# EAGLE design Shutdown Board (EAGLE 7.1.0)
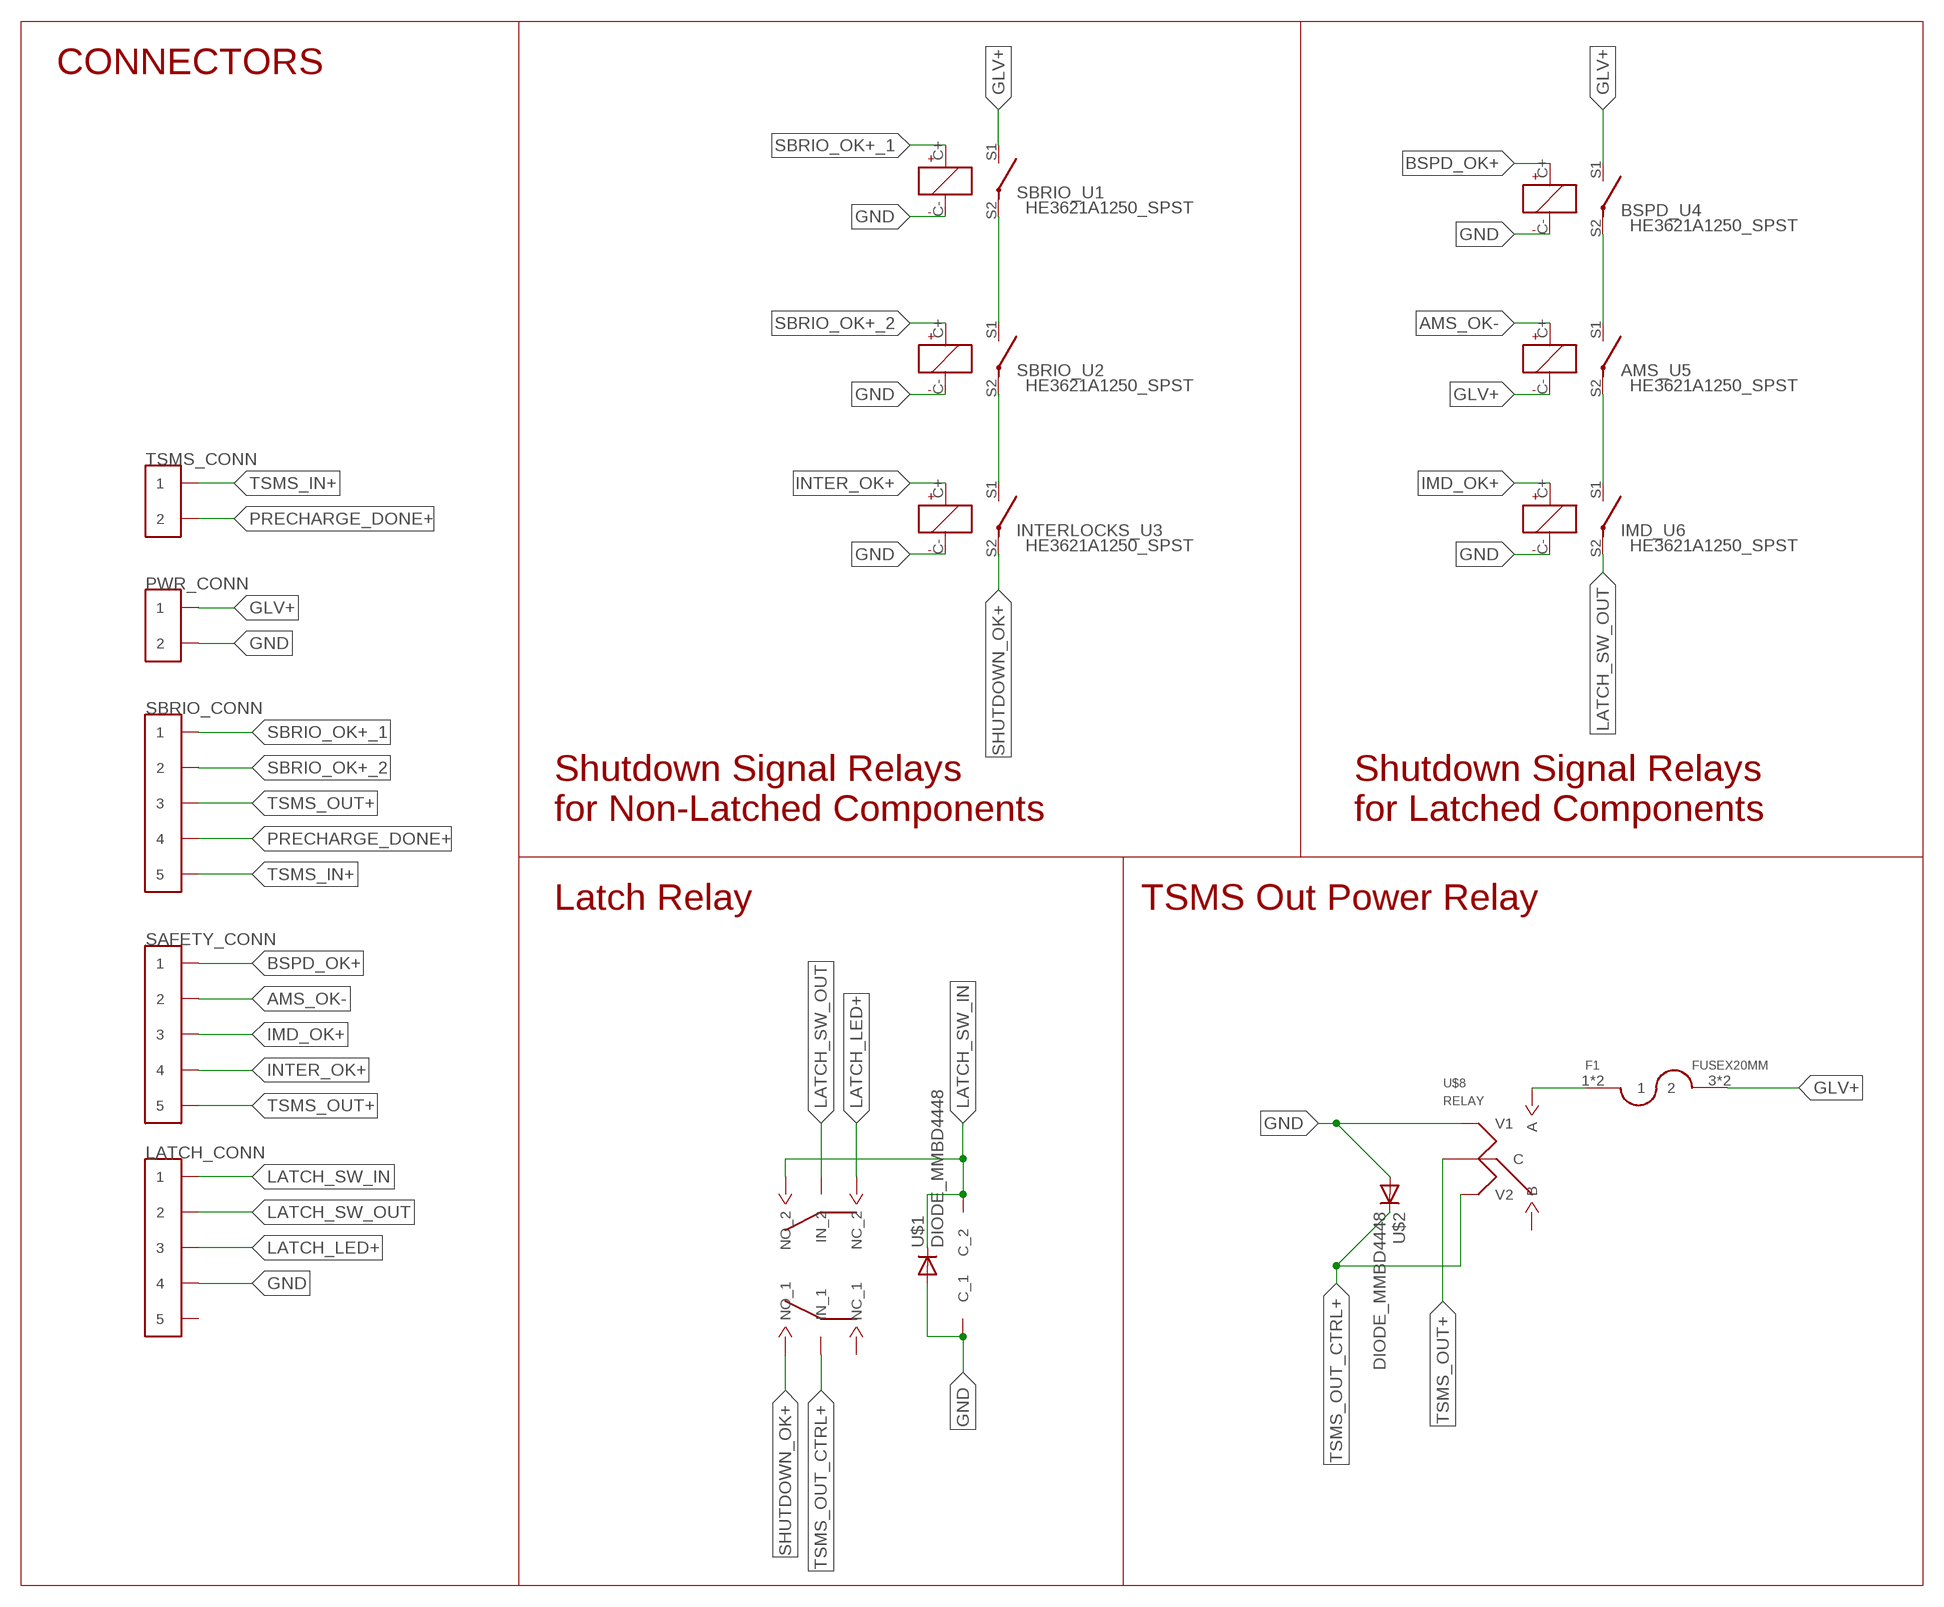
[diagram p0: schematic, sheet 1]

## Parts
AMS_U5  HE3621A1250_SPST  [HE3621A1250_SPST]
BSPD_U4  HE3621A1250_SPST  [HE3621A1250_SPST]
F1  FUSEX20MM  [FUSE_5MM]
IMD_U6  HE3621A1250_SPST  [HE3621A1250_SPST]
INTERLOCKS_U3  HE3621A1250_SPST  [HE3621A1250_SPST]
LATCH_CONN  CONN_5  [CONNECTOR_5]
LATCH_U7  JW2SN-DC12V  [DPDT_JW2_FORM_C]
PWR_CONN  CONN_2  [CONNECTOR_2]
SAFETY_CONN  CONN_5  [CONNECTOR_5]
SBRIO_CONN  CONN_5  [CONNECTOR_5]
SBRIO_U1  HE3621A1250_SPST  [HE3621A1250_SPST]
SBRIO_U2  HE3621A1250_SPST  [HE3621A1250_SPST]
TSMS_CONN  CONN_2  [CONNECTOR_2]
U$1  DIODE_MMBD4448  [SOT-23-3]
U$2  DIODE_MMBD4448  [SOT-23-3]
U$8  RELAY  [RELAY]

## Nets
AMS_OK-: AMS_U5.C+ SAFETY_CONN.3 SAFETY_CONN.4
BSPD_OK+: BSPD_U4.C+ SAFETY_CONN.1 SAFETY_CONN.2
GLV+: AMS_U5.C- BSPD_U4.S1(SW_1) F1.3 F1.4 PWR_CONN.1 PWR_CONN.2 SBRIO_U1.S1(SW_1)
GND: BSPD_U4.C- IMD_U6.C- INTERLOCKS_U3.C- LATCH_CONN.7 LATCH_CONN.8 LATCH_U7.COIL_1(C_1) PWR_CONN.3 PWR_CONN.4 SBRIO_U1.C- SBRIO_U2.C- U$1.P$2(A) U$2.P$2(A) U$8.V1
IMD_OK+: IMD_U6.C+ SAFETY_CONN.5 SAFETY_CONN.6
INTER_OK+: INTERLOCKS_U3.C+ SAFETY_CONN.7 SAFETY_CONN.8
LATCH_LED+: LATCH_CONN.5 LATCH_CONN.6 LATCH_U7.NC_2
LATCH_SW_IN: LATCH_CONN.1 LATCH_CONN.2 LATCH_U7.COIL_2(C_2) LATCH_U7.NO_2 U$1.P$1(C)
LATCH_SW_OUT: IMD_U6.S2(SW_2) LATCH_CONN.3 LATCH_CONN.4 LATCH_U7.CENTER_2(IN_2)
N$6: SBRIO_U1.S2(SW_2) SBRIO_U2.S1(SW_1)
N$7: INTERLOCKS_U3.S1(SW_1) SBRIO_U2.S2(SW_2)
N$8: AMS_U5.S1(SW_1) BSPD_U4.S2(SW_2)
N$9: AMS_U5.S2(SW_2) IMD_U6.S1(SW_1)
N$19: F1.1 F1.2 U$8.A
PRECHARGE_DONE+: SBRIO_CONN.7 SBRIO_CONN.8 TSMS_CONN.3 TSMS_CONN.4
SBRIO_OK+_1: SBRIO_CONN.1 SBRIO_CONN.2 SBRIO_U1.C+
SBRIO_OK+_2: SBRIO_CONN.3 SBRIO_CONN.4 SBRIO_U2.C+
SHUTDOWN_OK+: INTERLOCKS_U3.S2(SW_2) LATCH_U7.NO_1
TSMS_IN+: SBRIO_CONN.9 SBRIO_CONN.10 TSMS_CONN.1 TSMS_CONN.2
TSMS_OUT+: SAFETY_CONN.9 SAFETY_CONN.10 SBRIO_CONN.5 SBRIO_CONN.6 U$8.CENTER(C)
TSMS_OUT_CTRL+: LATCH_U7.CENTER_1(IN_1) U$2.P$1(C) U$8.V2
Unconnected: LATCH_CONN.9 LATCH_CONN.10 LATCH_U7.NC_1 U$8.B

## Notes on the sheet
- CONNECTORS
- Shutdown Signal Relays
  for Non-Latched Components
- Shutdown Signal Relays
  for Latched Components
- Latch Relay | TSMS Out Power Relay

## Library data of the parts
AMS_U5 BSPD_U4 IMD_U6 INTERLOCKS_U3 SBRIO_U1 SBRIO_U2 = formula electric:HE3621A1250_SPST
F1 = SparkFun-Passives:FUSE
LATCH_CONN SAFETY_CONN SBRIO_CONN = formula electric:CONN_5
LATCH_U7 = formula electric:JW2SN-DC12V: JW2SN-DC12V, DPDT 5A 12V Coil Relay, Digikey: 255-1117-ND
PWR_CONN TSMS_CONN = formula electric:CONN_2
U$1 U$2 = formula electric:DIODE_MMBD4448
U$8 = formula electric:RELAY: Digikey: PB1321-ND

## Board
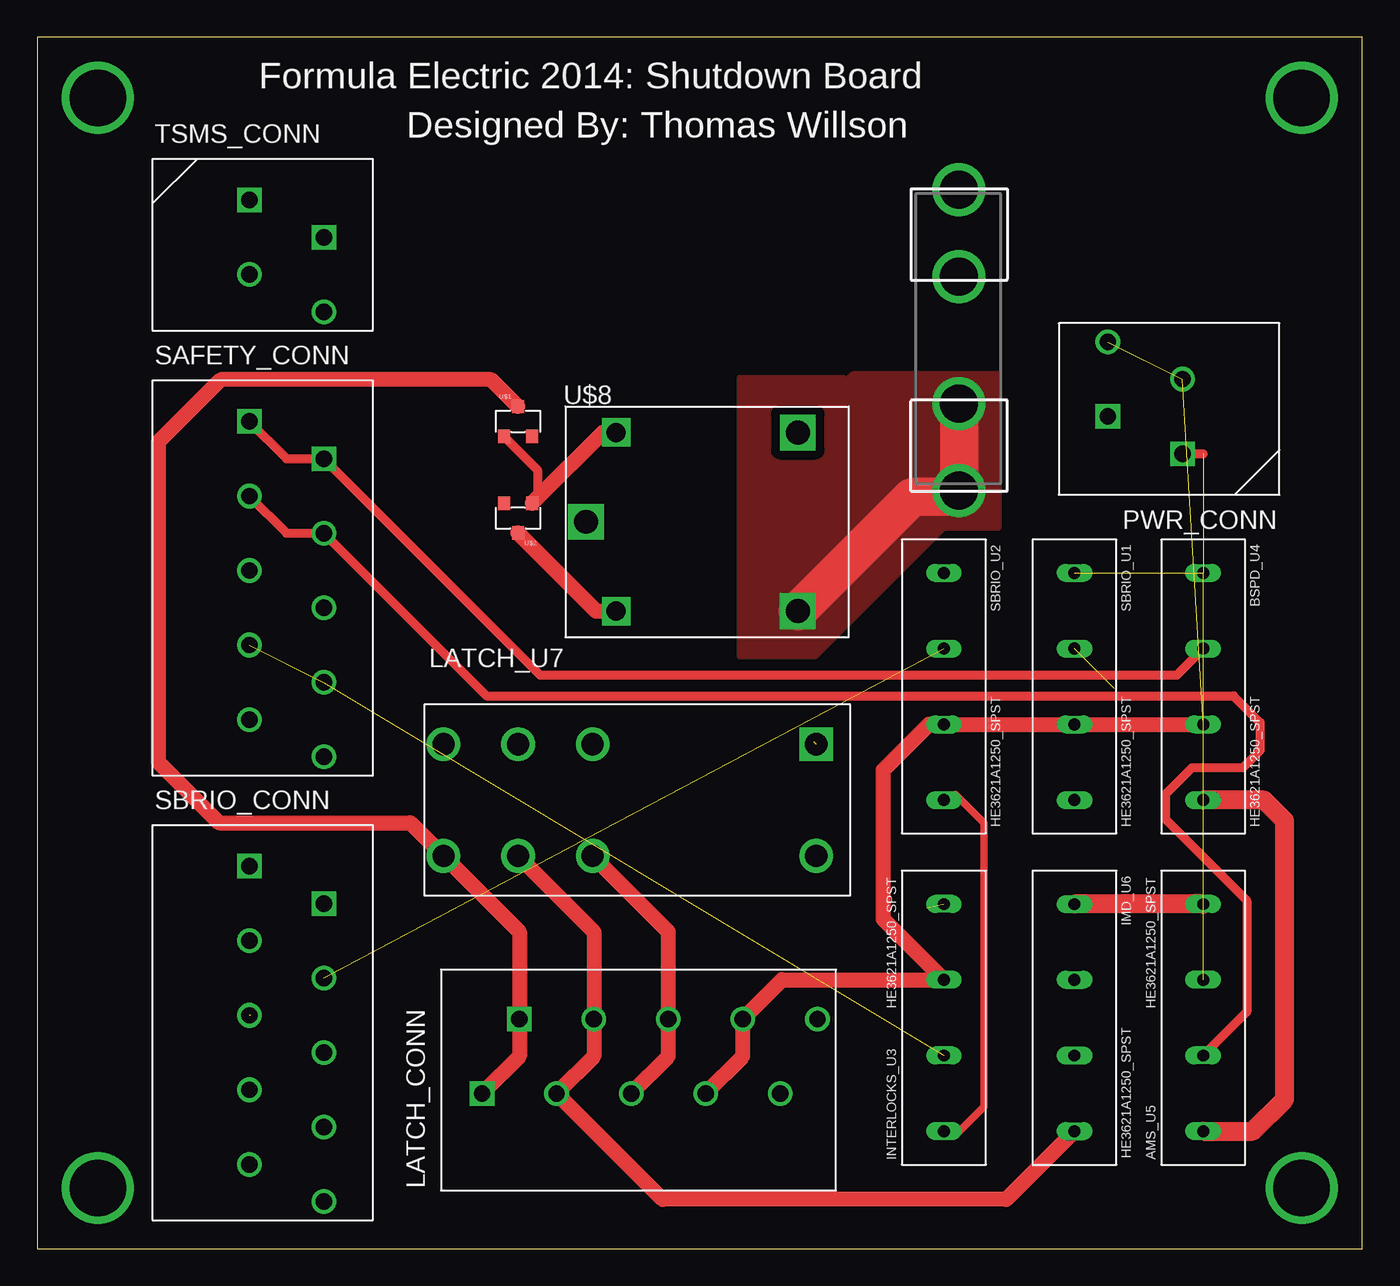
[diagram p1: board, top side]
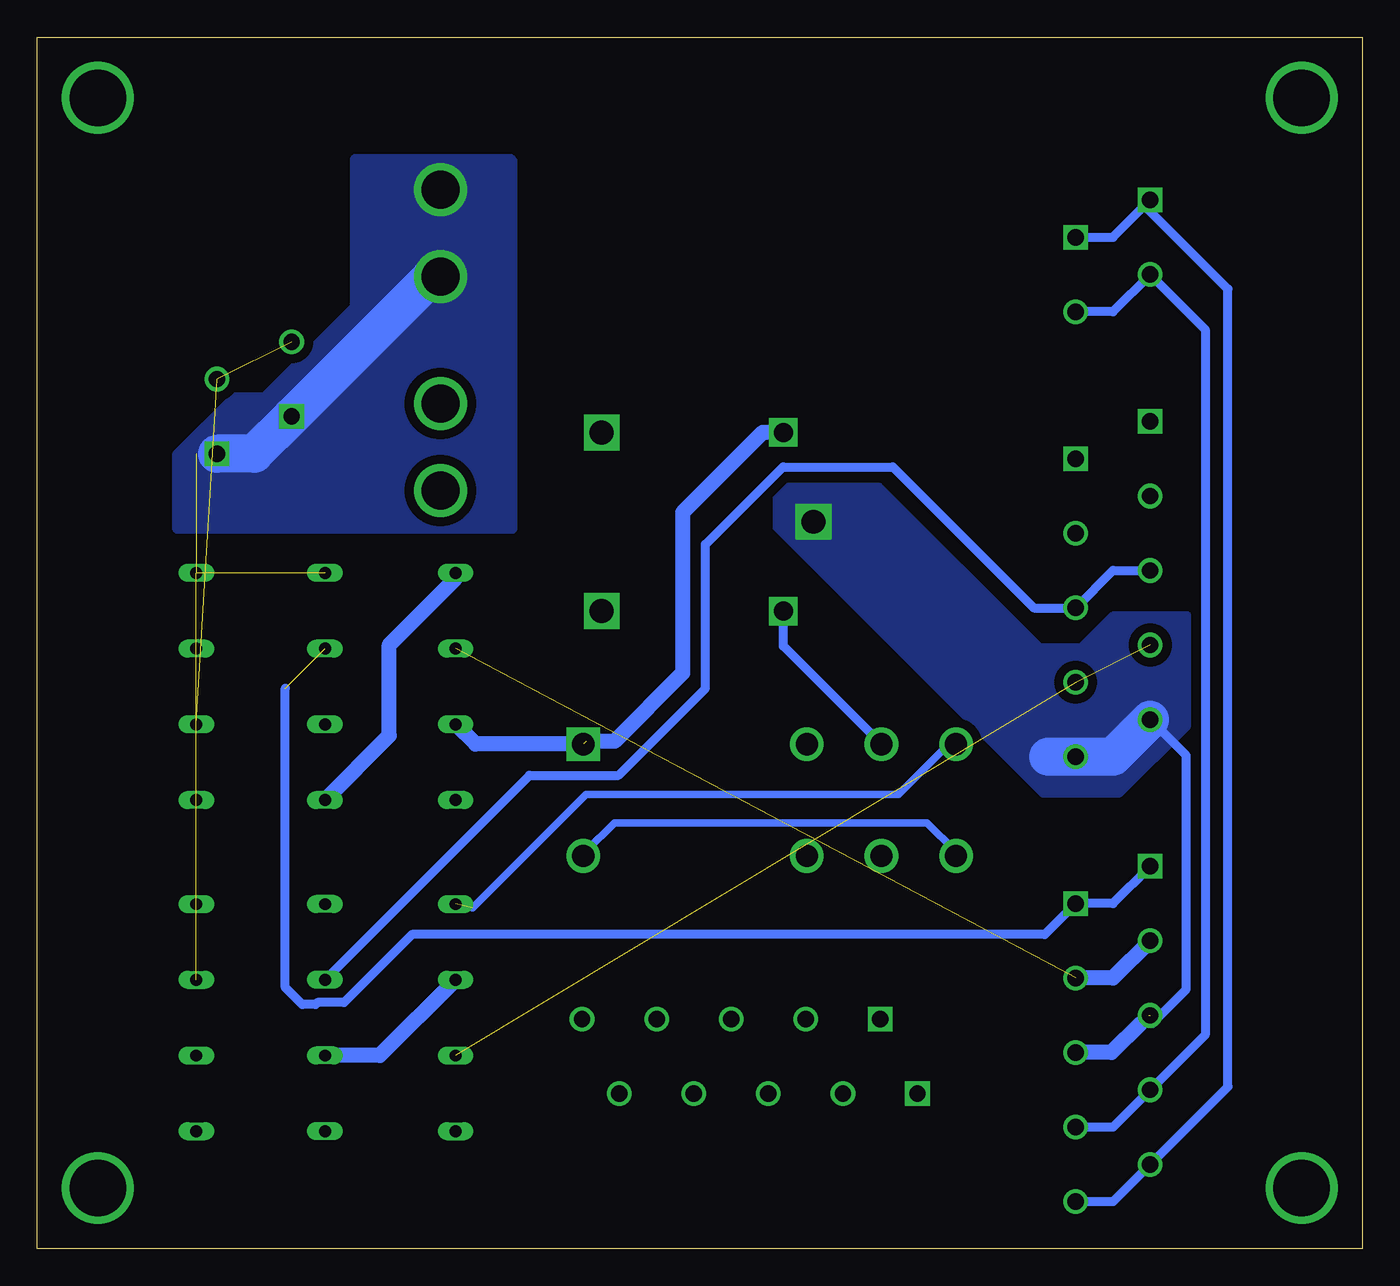
[diagram p2: board, bottom side, seen from below]

Size 88.9 x 81.28 mm. Coordinates in mm from the lower left corner, seen from the top.
Outline: 0,0 88.9,0 88.9,81.28 0,81.28 0,0
Copper layers (1*16): Top 0.0356mm / dielectric 1.5011mm / Bottom 0.0356mm
Design rules "OshPark DRC": minimum track width 6mil, minimum drill 13mil, track to track 6mil, track to pad 6mil, pad to pad 6mil, via to via 6mil, smd to smd 6mil, copper to edge 15mil, drill to drill 6mil, minimum pad ring 7mil, minimum via ring 7mil, stop-mask expansion 3mil, vias tented up to drill 0mil, thermal gap 10mil

### Footprints (pad centres in the part's own frame; a part is rotated, then mirrored left to right if it is on the bottom)
HE3621A1250_SPST = drill 0.8 long: C+ -2.54,0; C- 2.54,0; S1 -7.62,0; S2 7.62,0
FUSE_5MM = drill 2.54 pad 3.556: 1 0,-10.1; 2 0,-4.258; 3 0,4.258; 4 0,10.1
CONNECTOR_5 = drill 1.1 square: 1 0,0; 2 2.5,5 | drill 1.1: 3 5,0; 4 7.5,5; 5 10,0; 6 12.5,5; 7 15,0; 8 17.5,5; 9 20,0; 10 22.5,5
DPDT_JW2_FORM_C = drill 1.5: CENTER_1 -8,3.75; CENTER_2 -8,-3.75; COIL_2 12,-3.75; NC_1 -3,3.75; NC_2 -3,-3.75; NO_1 -13,3.75; NO_2 -13,-3.75 | drill 1.5 square: COIL_1 12,3.75
CONNECTOR_2 = drill 1.1 square: 1 0,0; 2 2.5,5 | drill 1.1: 3 5,0; 4 7.5,5
SOT-23-3 = smd 0.8 x 0.9: P$1 0,1; P$2 -0.95,-1; P$3 0.95,-1
RELAY = drill 1.6 square: A 14.199,-5.994; B 14.199,5.994; CENTER 0,0 | drill 1.27 square: V1 2.007,5.994; V2 2.007,-5.994

### Placement (x,y rotation side)
AMS_U5  78.23,15.49 90 top
BSPD_U4  78.23,37.72 270 top
F1  61.85,60.96 0 top
IMD_U6  69.6,15.49 270 top
INTERLOCKS_U3  60.83,15.49 90 top
LATCH_CONN  29.84,10.41 0 top
LATCH_U7  40.26,30.1 0 top
PWR_CONN  76.83,53.34 90 top
SAFETY_CONN  14.22,55.5 270 top
SBRIO_CONN  14.22,25.65 270 top
SBRIO_U1  69.6,37.72 270 top
SBRIO_U2  60.83,37.72 270 top
TSMS_CONN  14.22,70.36 270 top
U$1  32.26,55.5 0 top
U$2  32.26,49.02 180 top
U$8  36.83,48.77 0 top

### Tracks (layer width: path | path; a pad name or v marks a point on that pad's centre or on a via)
AMS_OK-
  Top 0.508: 78.74,13.34 AMS_U5.C+
  Top 0.61: SAFETY_CONN.3 16.72,48 SAFETY_CONN.4 30.14,37.08 80.26,37.08 82.04,35.31 82.04,33.4 80.9,32.26 77.47,32.26 75.69,30.48 75.69,28.83 81.15,23.37 81.15,15.88 AMS_U5.C+
BSPD_OK+
  Top 0.61: BSPD_U4.C+ 76.45,38.48 33.74,38.48 SAFETY_CONN.2 16.72,53 SAFETY_CONN.1
GLV+  (3 unrouted)
  Top 0.61: PWR_CONN.1 78.23,53.34
  Bottom 2.54: 62.56,65.12 PWR_CONN.2 74.33,53.34 PWR_CONN.1
  pour Bottom (isolate 0.61, rank 2, no thermals): 56.9,73.03 56.9,48.26 57.02,48.13 79.5,48.13 79.63,48.26 79.63,53.34 75.69,57.28 73.66,57.28 67.69,63.25 67.69,73.15 67.56,73.28 57.15,73.28 57.02,73.15
GND  (3 unrouted)
  Top 0.61: U$1.P$2 33.57,52.24 33.57,50.38
  Top 1.016: U$2.P$2 33.57,50.38 37.95,54.76 U$8.V1 | LATCH_CONN.7 47.34,12.91 LATCH_CONN.8 49.97,18.03 INTERLOCKS_U3.C- 56.77,22.1 56.77,32.13 59.82,35.18 SBRIO_U2.C- SBRIO_U1.C- BSPD_U4.C-
  Bottom 1.016: U$8.V1 40.23,54.76 45.59,49.4 45.59,38.61 50.16,34.04 52.07,34.04 | LATCH_U7.COIL_1 59.5,33.85 SBRIO_U2.C- | INTERLOCKS_U3.C- 65.91,12.95 IMD_U6.C-
IMD_OK+
  Bottom 0.61: IMD_U6.C+ 55.88,31.75 49.91,31.75 44.07,37.59 44.07,47.24 38.86,52.45 31.5,52.45 22.04,43 SAFETY_CONN.6 16.72,45.5 SAFETY_CONN.5
INTER_OK+  (2 unrouted)
LATCH_LED+
  Top 1.016: LATCH_CONN.5 42.34,12.91 LATCH_CONN.6 42.34,21.26 LATCH_U7.NC_2
LATCH_SW_IN
  Top 1.016: U$1.P$1 30.46,58.29 12.32,58.29 8.13,54.1 8.13,32.64 12.19,28.57 25.03,28.57 LATCH_U7.NO_2 32.34,21.26 LATCH_CONN.2 32.34,12.91 LATCH_CONN.1
  Bottom 0.508: LATCH_U7.NO_2 27.3,26.67 29.21,28.57 50.16,28.57 52.07,26.67 LATCH_U7.COIL_2
LATCH_SW_OUT
  Top 1.016: LATCH_U7.CENTER_2 37.34,21.26 LATCH_CONN.4 37.34,12.91 LATCH_CONN.3 41.96,3.3 65.02,3.3 IMD_U6.S2
N$6
  Bottom 1.016: SBRIO_U1.S2 65.28,34.42 65.28,40.51 60.83,44.96 SBRIO_U2.S1
N$7
  Top 0.508: INTERLOCKS_U3.S1 61.59,7.62 63.5,9.53 63.5,28.57 61.59,30.48 SBRIO_U2.S2
N$8
  Top 1.27: AMS_U5.S1 81.53,7.87 83.69,10.03 83.69,28.7 82.3,30.1 BSPD_U4.S2
N$9
  Top 1.27: AMS_U5.S2 IMD_U6.S1
N$15  (via drill 3.8)
  other vias: 84.84,77.22
N$16  (via drill 3.8)
  other vias: 4.06,4.06
N$17  (via drill 3.8)
  other vias: 4.06,77.22
N$18  (via drill 3.8)
  other vias: 84.84,4.06
N$19
  Top 2.54: F1.2 61.85,50.67 62.1,50.42 58.67,50.42 U$8.A
  pour Top (isolate 0.61, no thermals): 54.23,58.29 54.1,58.42 47.12,58.42 47.12,39.75 52.2,39.75 60.83,48.39 64.52,48.39 64.52,58.67 54.74,58.67 54.36,58.29
PRECHARGE_DONE+
  Bottom 0.61: TSMS_CONN.4 16.72,62.86 TSMS_CONN.3 10.54,61.67 10.54,14.34 SBRIO_CONN.7 16.72,8.15 SBRIO_CONN.8
SBRIO_OK+_1  (1 unrouted)
  Bottom 0.61: SBRIO_CONN.1 16.72,23.15 SBRIO_CONN.2 21.3,21.08 63.75,21.08 68.33,16.51 70.1,16.51 70.23,16.38 71.12,16.38 72.26,17.53 72.26,37.59
SBRIO_OK+_2  (1 unrouted)
  Bottom 1.016: SBRIO_CONN.3 16.72,18.15 SBRIO_CONN.4
SHUTDOWN_OK+  (1 unrouted)
  Bottom 0.508: 59.69,22.86 52.07,30.48 31.11,30.48 27.3,34.29 LATCH_U7.NO_1
TSMS_IN+
  Bottom 0.61: TSMS_CONN.2 16.72,67.86 14.61,69.98 | 14.61,69.98 TSMS_CONN.1 | 14.61,69.98 9.02,64.39 9.02,10.86 SBRIO_CONN.9 16.72,3.15 SBRIO_CONN.10
TSMS_OUT+  (1 unrouted)
  Bottom 0.61: 14.32,15.65 14.86,15.11 14.1,15.11 11.81,17.4 11.81,33.09 SAFETY_CONN.9
  Bottom 1.016: 14.86,15.11 16.82,13.15 SBRIO_CONN.6
  Bottom 2.54: SAFETY_CONN.9 16.72,33 SAFETY_CONN.10 21.06,33
  pour Bottom (isolate 0.61, rank 2, no thermals): 39.37,50.55 39.37,48.39 21.46,30.48 16.26,30.48 11.68,35.05 11.68,42.55 16.76,42.55 18.92,40.39 21.59,40.39 32.38,51.18 38.73,51.18
TSMS_OUT_CTRL+
  Top 1.016: U$2.P$1 37.51,42.77 U$8.V2
  Bottom 0.61: U$8.V2 38.84,40.43 LATCH_U7.CENTER_1

### Text on the board
tNames: Formula Electric 2014: Shutdown Board | Designed By: Thomas Willson